# Altium schematic sheet BLETracker_v03.SchDoc
size A
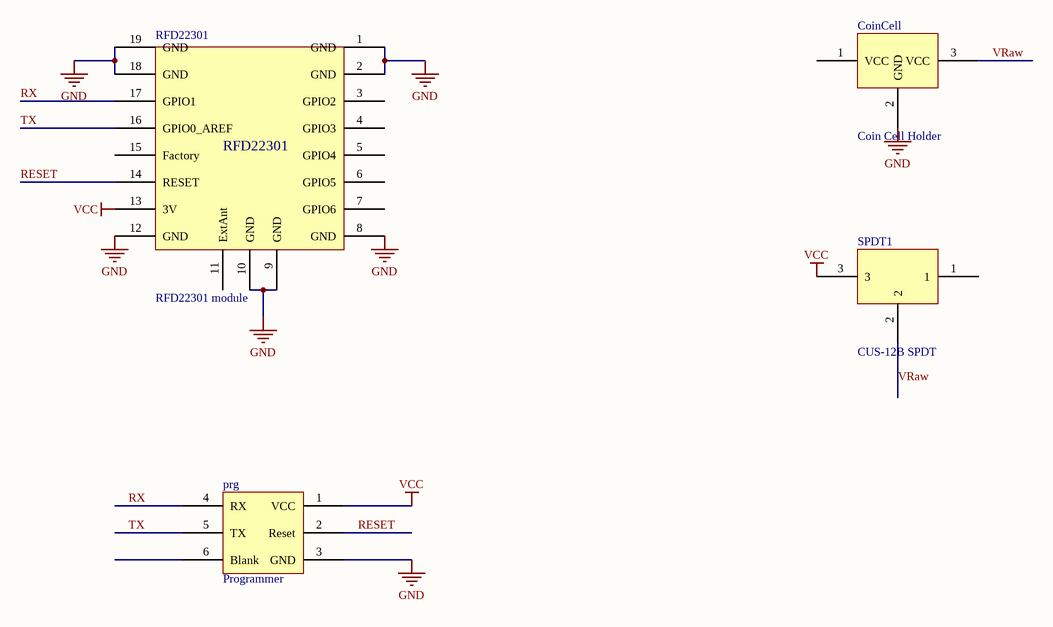
[diagram p0: BLETracker_v03.SchDoc]

## Parts
CoinCell  Coin Cell Holder  [CoinCell]
prg  Programmer  [ProgrammingHeader]
RFD22301  RFD22301 module  [RFD22301]
SPDT1  CUS-12B SPDT  [CUS-12B]

## Nets
GND: CoinCell.2(GND) prg.3(GND) RFD22301.1(GND) RFD22301.2(GND) RFD22301.8(GND) RFD22301.9(GND) RFD22301.10(GND) RFD22301.12(GND) RFD22301.18(GND) RFD22301.19(GND)
VCC: prg.1(VCC) RFD22301.13(3V) SPDT1.3
RESET: prg.2(Reset) RFD22301.14(RESET)
RX: prg.4(RX) RFD22301.17(GPIO1)
TX: prg.5(TX) RFD22301.16(GPIO0_AREF)
VRaw: CoinCell.3(VCC) SPDT1.2

Not connected (* = marked no-connect by the designer): CoinCell 1(VCC); prg 6(Blank); RFD22301 3(GPIO2) 4(GPIO3) 5(GPIO4) 6(GPIO5) 7(GPIO6) 11(ExtAnt) 15(Factory); SPDT1 1

## Library data of the parts
CoinCell = CoinCellHolder
prg = ProgrammingHeader
RFD22301 = RFD22301_Footprint
SPDT1 = CUS-12B